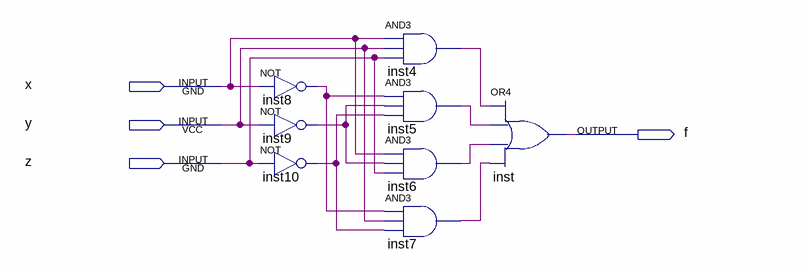
[diagram p0: schematic sheet]
// Quartus schematic 2-2-2-before.bdf as structural Verilog: 8 symbols, 4 pins
module \2-2-2-before  (
  input  x,
  input  y,
  input  z,
  output f
);

  wire inst4_out, inst5_out, inst6_out, inst7_out, inst8_out, inst9_out, inst10_out;

  not inst8 (inst8_out, x);
  not inst9 (inst9_out, y);
  not inst10 (inst10_out, z);
  and inst4 (inst4_out, x, y, z);
  and inst5 (inst5_out, inst8_out, inst9_out, inst10_out);
  and inst6 (inst6_out, x, inst9_out, z);
  and inst7 (inst7_out, inst8_out, y, inst10_out);
  or inst (f, inst4_out, inst5_out, inst6_out, inst7_out);
endmodule
